# EasyEDA Pro project gamepad.eprj

# Schematic Schematic1
Board Name: Board1; Create Date: 2025-08-29; Page Name: P1; Project Name: gamepad; Schematic Name: Schematic1; Update Date: 2025-08-31; Company: EasyEDA.com; Page Size: A4; Version: V1.0
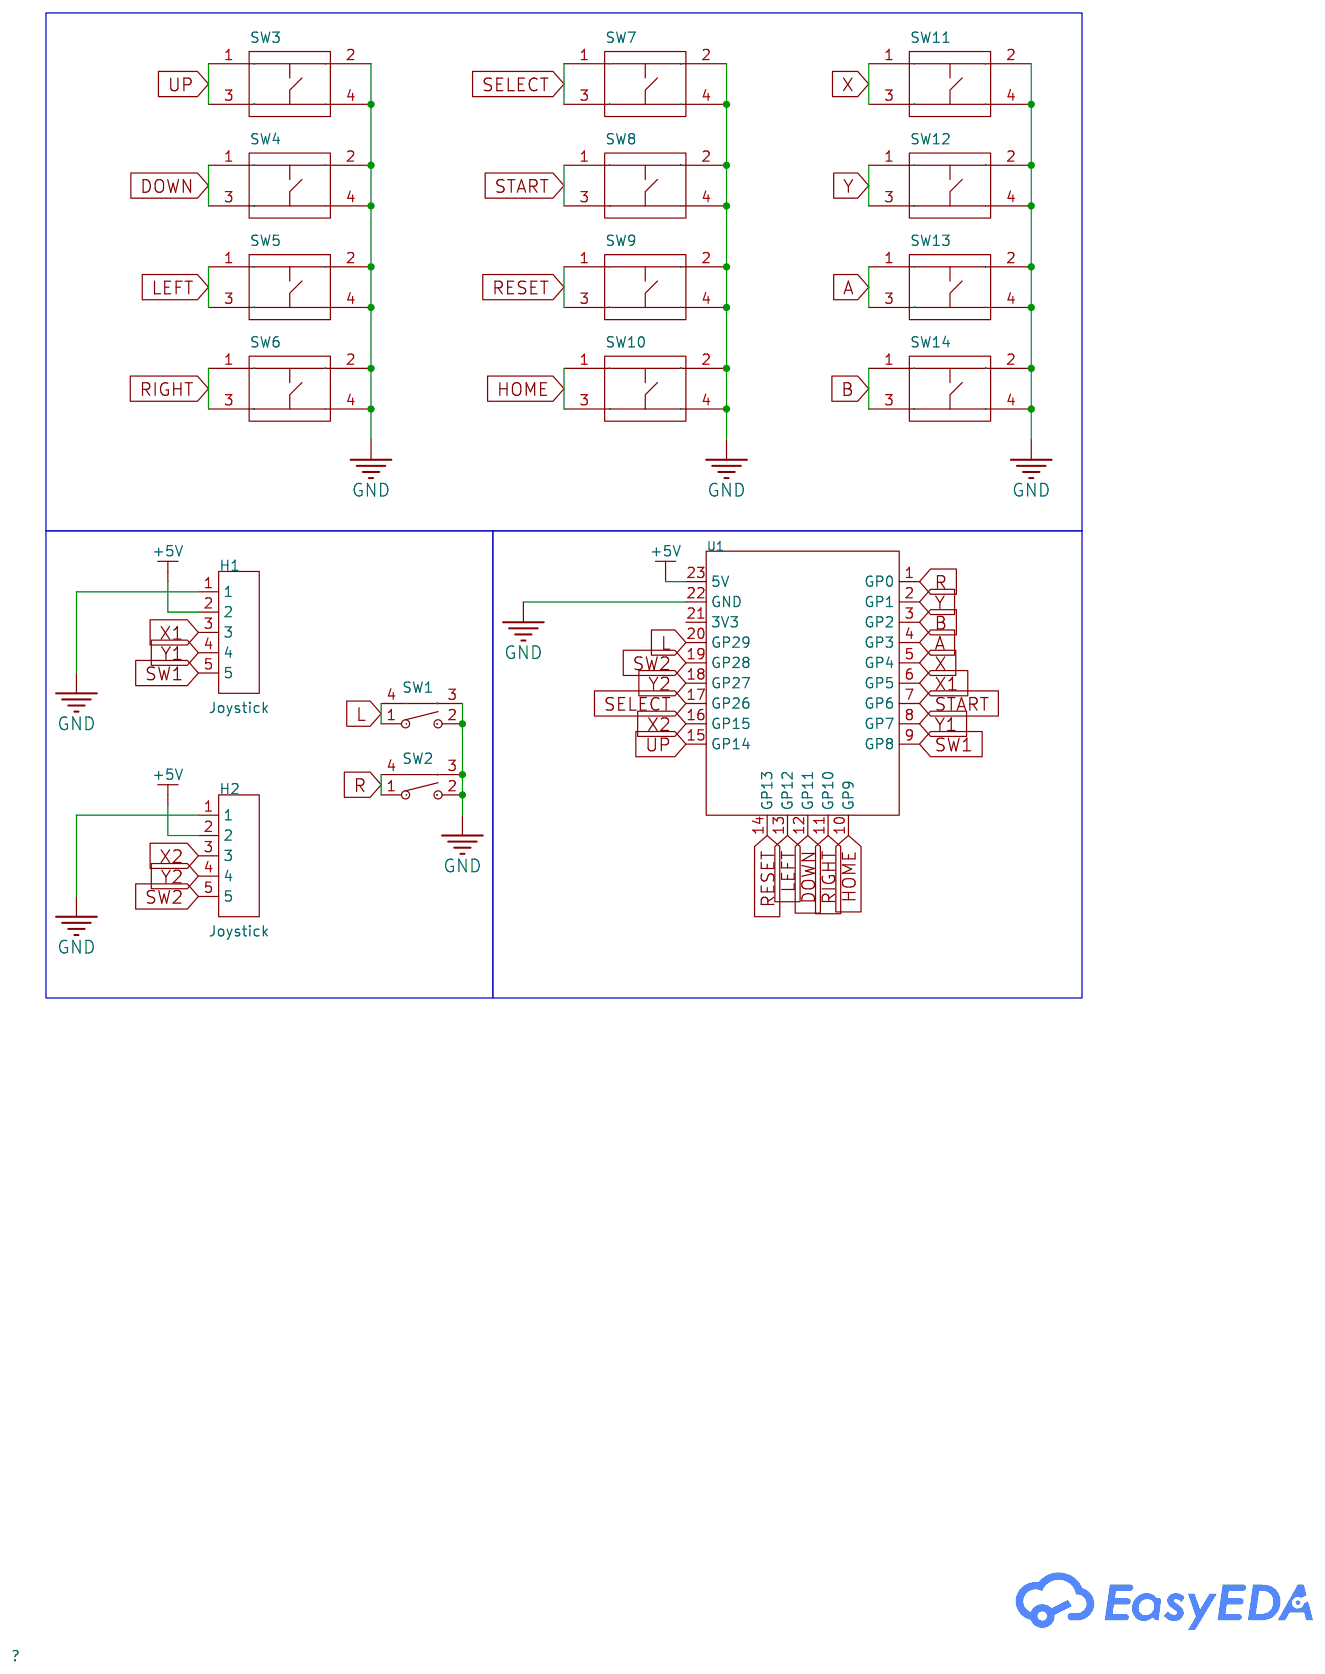
[diagram p0: schematic sheet]

## Parts
H1  Joystick  [HDR-TH_5P-P2.54_HTSW-105-08-F-S]
H2  Joystick  [HDR-TH_5P-P2.54_HTSW-105-08-F-S]
SW1  K2-1102AQ-H4CW-01  [SW-TH_K2-1102BQ-G4CW-01]
SW2  K2-1102AQ-H4CW-01  [SW-TH_K2-1102BQ-G4CW-01]
SW3  K2-1102DP-C4SW-04  [KEY-TH_4P-L6.0-W6.0-P4.50-LS6.50]
SW4  K2-1102DP-C4SW-04  [KEY-TH_4P-L6.0-W6.0-P4.50-LS6.50]
SW5  K2-1102DP-C4SW-04  [KEY-TH_4P-L6.0-W6.0-P4.50-LS6.50]
SW6  K2-1102DP-C4SW-04  [KEY-TH_4P-L6.0-W6.0-P4.50-LS6.50]
SW7  K2-1102DP-C4SW-04  [KEY-TH_4P-L6.0-W6.0-P4.50-LS6.50]
SW8  K2-1102DP-C4SW-04  [KEY-TH_4P-L6.0-W6.0-P4.50-LS6.50]
SW9  K2-1102DP-C4SW-04  [KEY-TH_4P-L6.0-W6.0-P4.50-LS6.50]
SW10  K2-1102DP-C4SW-04  [KEY-TH_4P-L6.0-W6.0-P4.50-LS6.50]
SW11  K2-1102DP-C4SW-04  [KEY-TH_4P-L6.0-W6.0-P4.50-LS6.50]
SW12  K2-1102DP-C4SW-04  [KEY-TH_4P-L6.0-W6.0-P4.50-LS6.50]
SW13  K2-1102DP-C4SW-04  [KEY-TH_4P-L6.0-W6.0-P4.50-LS6.50]
SW14  K2-1102DP-C4SW-04  [KEY-TH_4P-L6.0-W6.0-P4.50-LS6.50]
U1  RP2040-Zero  [RP2040_Zero]

## Library data of the parts
H1 H2 = MTSW-105-22-F-S-370: Pitch:2.54mm Mounting Type:Through Hole Number of Rows:1 Number of Pins:5P Current Rating:3A Contact Material:Phosphor Bronze Contact Plating:Tin Operating Temperature:-55℃~+125℃ Operating Temperature:-55℃~+125℃ Color:Black; LCSC Part Name: 间距:2.54mm 直插; Supplier Part: C5791520; Manufacturer: SAMTEC; Supplier Footprint: 插件,P=2.54mm; JLCPCB Part Class: Extended Part; Datasheet: https://item.szlcsc.com/datasheet/MTSW-105-22-F-S-370/6719220.html; Supplier: LCSC; Pitch: 2.54mm; Mounting Type: Through Hole; Number of Rows: 1; Number of Pins: 5P; Current Rating: 3A; Contact Material: Phosphor Bronze; Contact Plating: Tin; Operating Temperature: -55℃~+125℃; Color: Black
SW1 SW2 = K2-1102AQ-H4CW-01: LCSC Part Name: 6*6*7.5 带支架侧按键; Supplier Part: C961738; Manufacturer: 韩国韩荣; Supplier Footprint: 插件; Datasheet: https://atta.szlcsc.com/upload/public/pdf/source/20200930/C879477_AE832093E9AD0259B01FEE80C7CCB682.pdf; Supplier: LCSC; Operating Force: 250gf; Mounting Style: Lying; Switch Length: 6mm; Switch Width: 6mm; Switch Height: 7.5mm; Strike Gundam: 带支架; Contact Current: 50mA; Voltage Rating (DC): 12V; Insulation Resistance: 100MΩ; Mechanical Life: 10万次; Operating Temperature: -25℃~+85℃
SW3-SW14 = K2-1102DP-C4SW-04: LCSC Part Name: 轻触按键开关6*6*5; Supplier Part: C110153; Manufacturer: 韩国韩荣; Supplier Footprint: 插件; Datasheet: https://atta.szlcsc.com/upload/public/pdf/source/20210810/D0CD9D77408EACA829A5E533AC6E5B1E.pdf; Supplier: LCSC; Circuit: SPST; Actuator Style: Round Button; Operating Force: 250gf; Mounting Style: Straight; Switch Length: 6mm; Switch Width: 6mm; Switch Height: 5mm; Contact Current: 50mA; Voltage Rating (DC): 12V; Insulation Resistance: 100MΩ; Mechanical Life: 10万次; Operating Temperature: -25℃~+85℃
U1 = RP2040-Zero: LCSC Part Name: 微雪 树莓派RP2040-Zero微控制器 PICO开发板 RP2040双核处理器; Supplier Part: C5350143; Manufacturer: Waveshare(微雪电子); Supplier Footprint: LCC-22(18x23.5); JLCPCB Part Class: Extended Part; Datasheet: https://item.szlcsc.com/datasheet/RP2040-Zero/6136910.html; Supplier: LCSC

## Nets
+5V: H1.2 H2.2 U1.23(5V)
GND: H1.1 H2.1 SW1.2 SW1.3 SW2.2 SW2.3 SW3.2 SW3.4 SW4.2 SW4.4 SW5.2 SW5.4 SW6.2 SW6.4 SW7.2 SW7.4 SW8.2 SW8.4 SW9.2 SW9.4 SW10.2 SW10.4 SW11.2 SW11.4 SW12.2 SW12.4 SW13.2 SW13.4 SW14.2 SW14.4 U1.22(GND)
A: SW13.1 SW13.3 U1.4(GP3)
B: SW14.1 SW14.3 U1.3(GP2)
DOWN: SW4.1 SW4.3 U1.12(GP11)
HOME: SW10.1 SW10.3 U1.10(GP9)
L: SW1.1 SW1.4 U1.20(GP29)
LEFT: SW5.1 SW5.3 U1.13(GP12)
R: SW2.1 SW2.4 U1.1(GP0)
RESET: SW9.1 SW9.3 U1.14(GP13)
RIGHT: SW6.1 SW6.3 U1.11(GP10)
SELECT: SW7.1 SW7.3 U1.17(GP26)
START: SW8.1 SW8.3 U1.7(GP6)
SW1: H1.5 U1.9(GP8)
SW2: H2.5 U1.19(GP28)
UP: SW3.1 SW3.3 U1.15(GP14)
X: SW11.1 SW11.3 U1.5(GP4)
X1: H1.3 U1.6(GP5)
X2: H2.3 U1.16(GP15)
Y: SW12.1 SW12.3 U1.2(GP1)
Y1: H1.4 U1.8(GP7)
Y2: H2.4 U1.18(GP27)

Not connected (* = marked no-connect by the designer): U1 21(3V3)

# Board PCB1
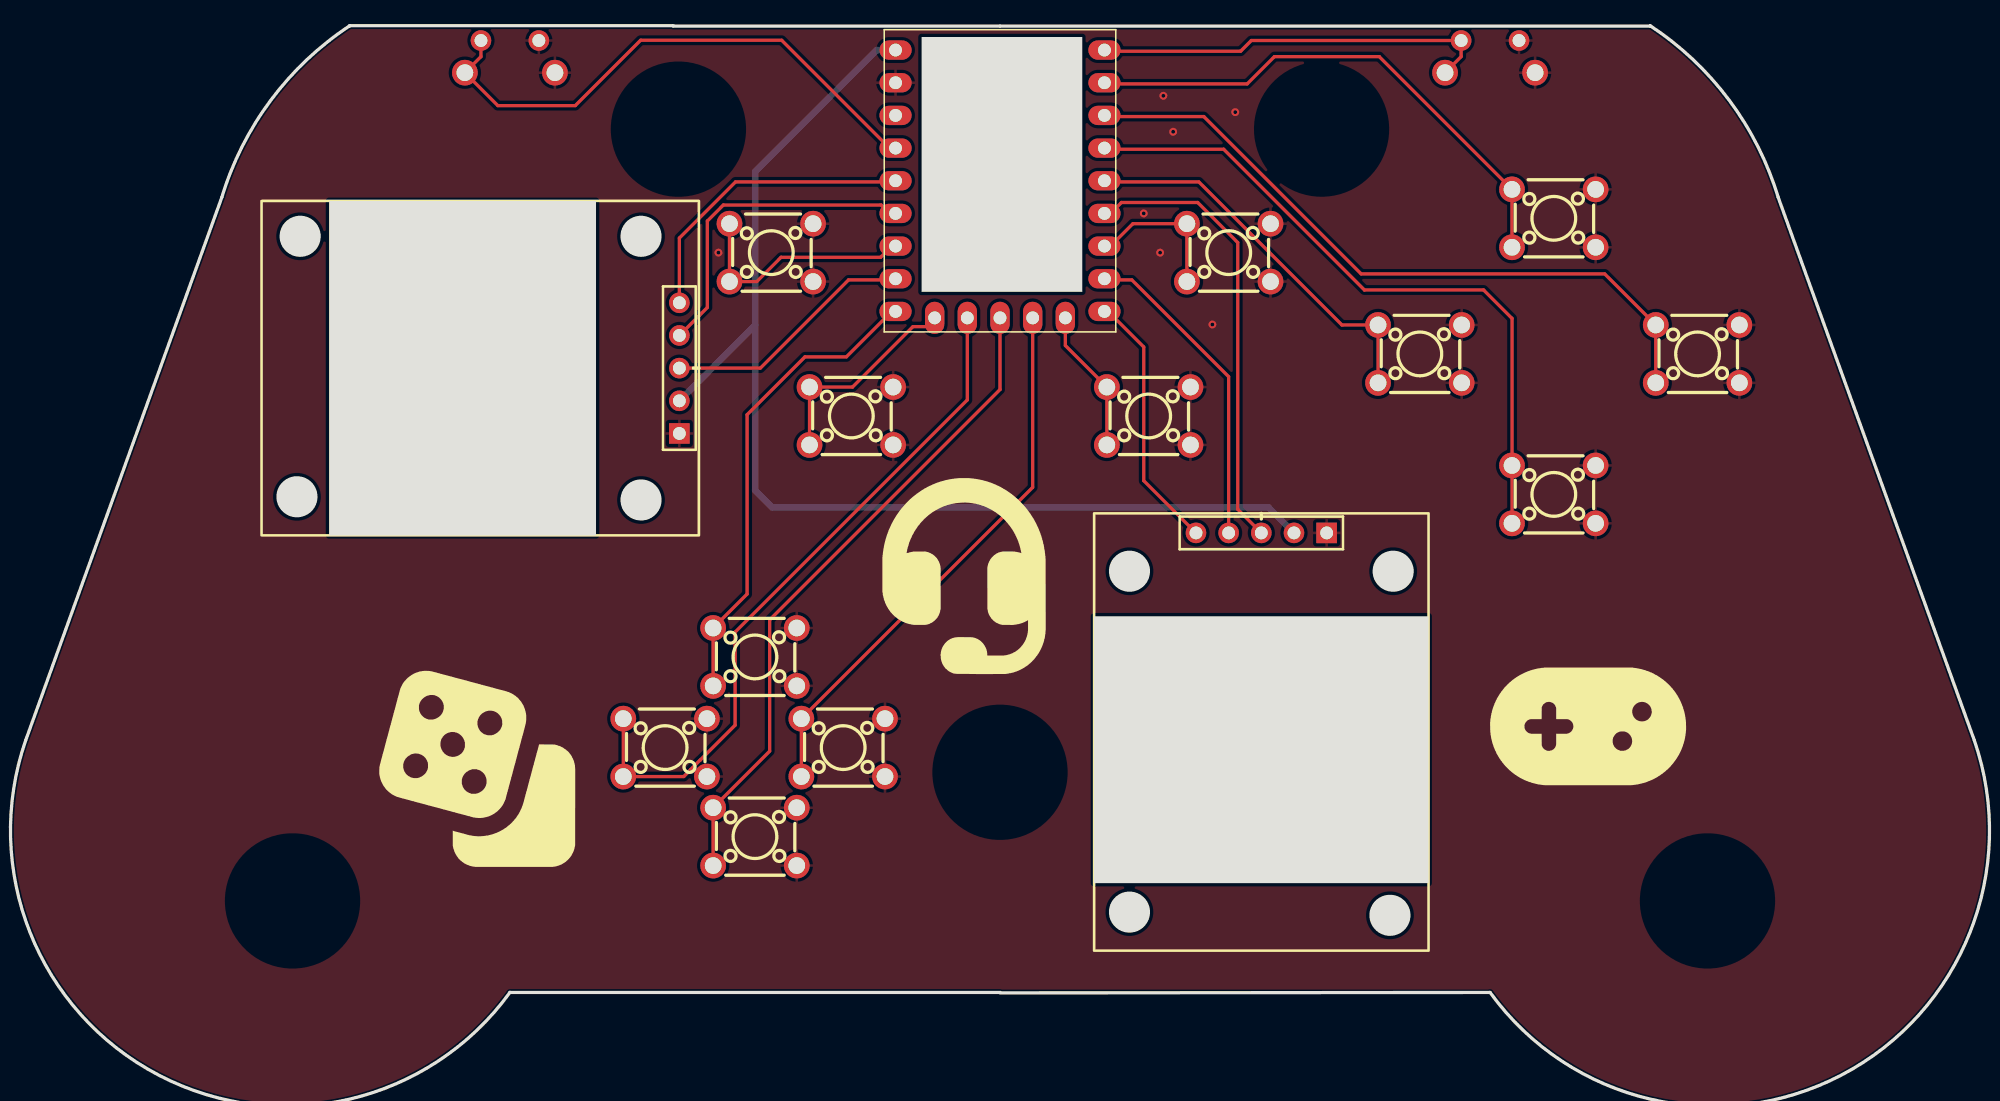
[diagram p1: board, top side]
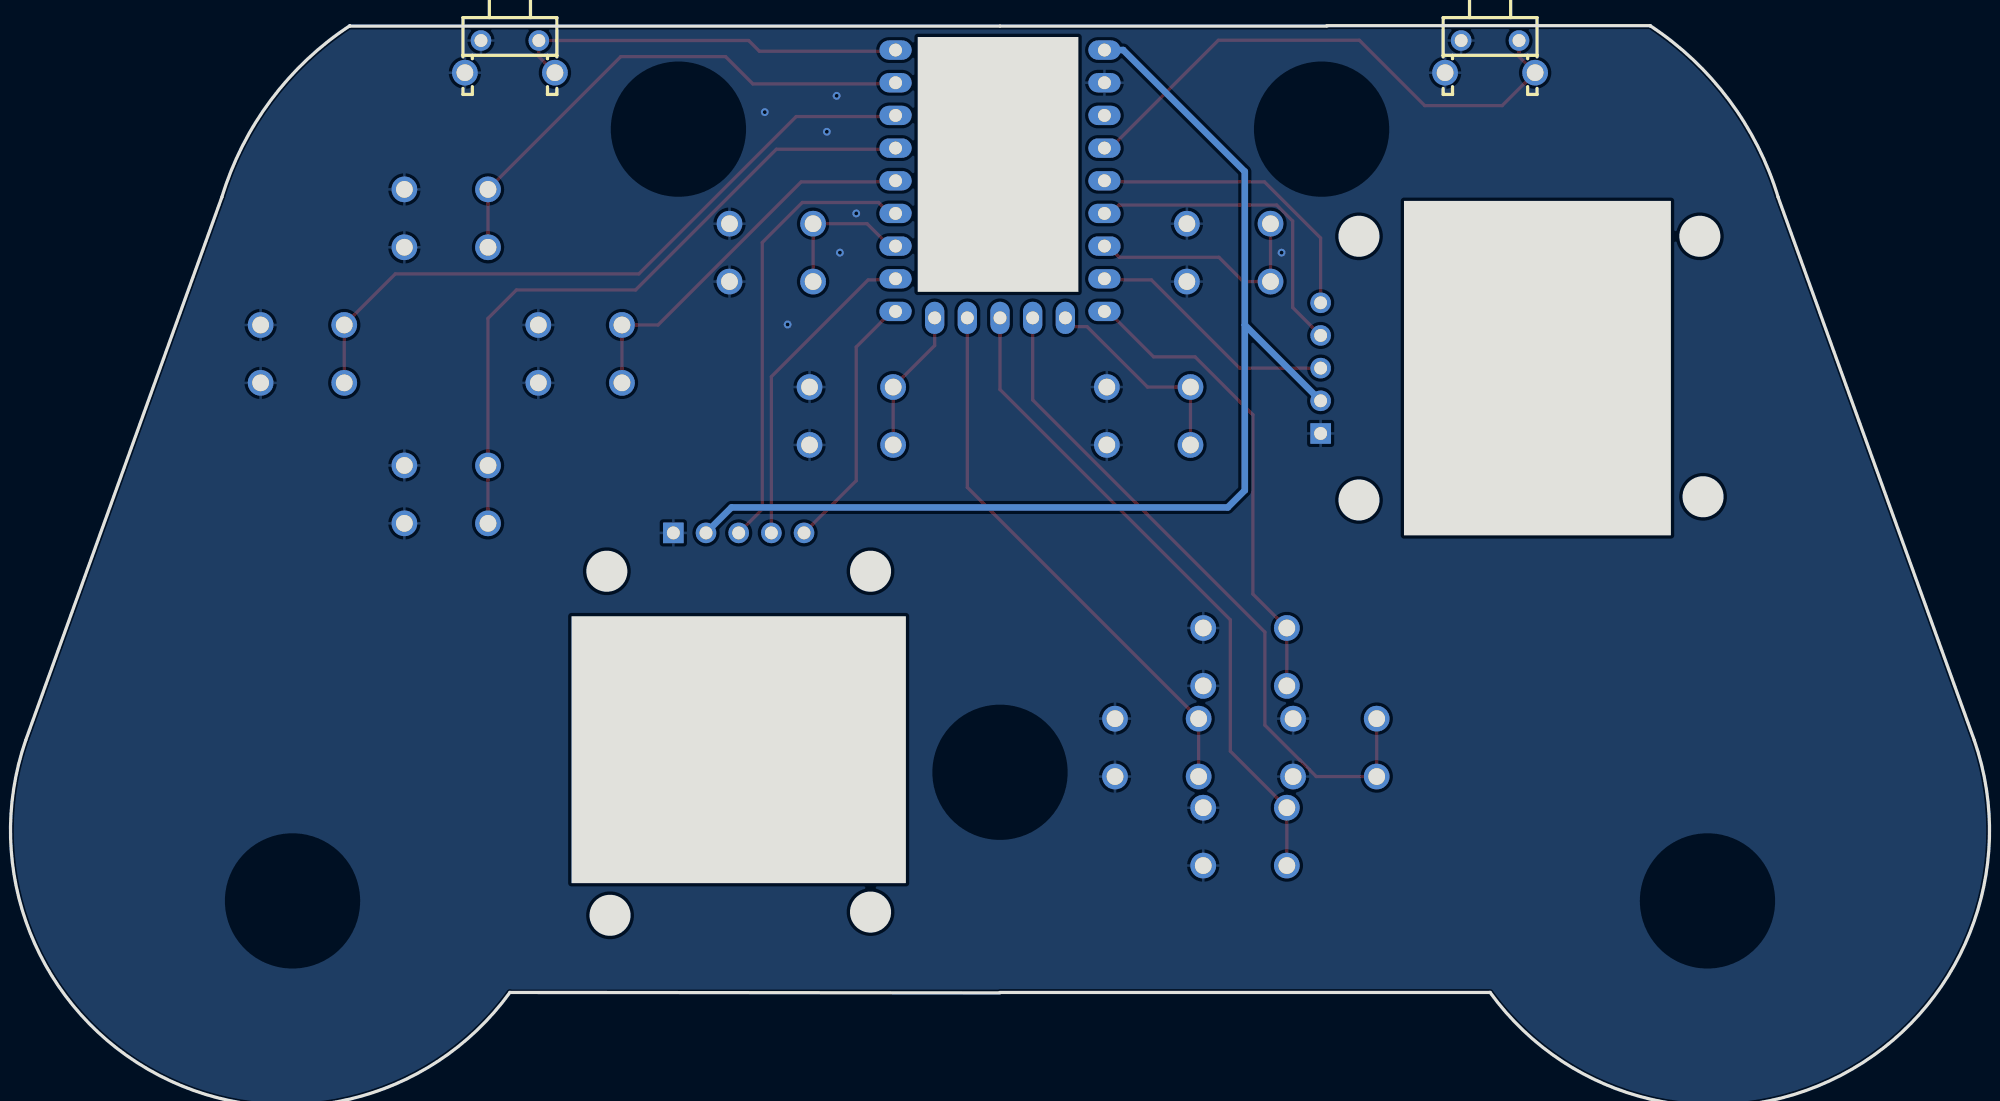
[diagram p2: board, bottom side, seen from below]

Outline 153.84 x 84.02 mm; copper layers: Top Layer, Bottom Layer. Coordinates in mm from the lower left corner of the outline.
Outline path: 26.37,84.03 arc(20.23,78.23) 16.43,70.7 1.18,28.48 arc(11.54,2.43) 38.82,8.87 76.92,8.87 ; 26.37,84.03 26.36,84.01 ; 26.37,84.03 51.52,84.03 ; 51.52,84 127.47,84 127.47,84.03 arc(133.61,78.24) 137.41,70.7 152.66,28.48 arc(142.3,2.43) 115.02,8.87 76.92,8.83
Stack: Top Layer 0.035mm / Dielectric1 1.51mm FR4 er 4.5 / Bottom Layer 0.035mm

## Design rules (mm)
template: JLCPCB Capability(Two Layers Board)
spacing copperThickness1oz (default): track to track 0.102, other pairs 0.152 to 0.3
spacing copperThickness2oz: track to track 0.203, other pairs 0.152 to 0.3
track width copperThickness1oz (default): min 0.127, default 0.254, max 2.54
track width copperThickness2oz: min 0.203, default 0.254, max 2.54
differential pair differentialPair (default): width min 0.127, default 0.254, max 2.54; gap min 0.152, default 0.152
via viaSize (default): diameter min 0.5, default 0.61, max 10; hole min 0.3, default 0.305, max 6.3

## Placement (name value [footprint] x y rotation side)
H1  Joystick  [HDR-TH_5P-P2.54_HTSW-105-08-F-S]  97.24 44.85 180 top
H2  Joystick  [HDR-TH_5P-P2.54_HTSW-105-08-F-S]  52.24 57.41 90 top
SW1  K2-1102AQ-H4CW-01  [SW-TH_K2-1102BQ-G4CW-01]  38.82 81.63 0 bottom
SW2  K2-1102AQ-H4CW-01  [SW-TH_K2-1102BQ-G4CW-01]  115.02 81.63 0 bottom
SW3  K2-1102DP-C4SW-04  [KEY-TH_4P-L6.0-W6.0-P4.50-LS6.50]  57.87 34.95 0 top
SW4  K2-1102DP-C4SW-04  [KEY-TH_4P-L6.0-W6.0-P4.50-LS6.50]  57.87 20.98 0 top
SW5  K2-1102DP-C4SW-04  [KEY-TH_4P-L6.0-W6.0-P4.50-LS6.50]  50.89 27.9 0 top
SW6  K2-1102DP-C4SW-04  [KEY-TH_4P-L6.0-W6.0-P4.50-LS6.50]  64.73 27.9 0 top
SW7  K2-1102DP-C4SW-04  [KEY-TH_4P-L6.0-W6.0-P4.50-LS6.50]  59.14 66.39 0 top
SW8  K2-1102DP-C4SW-04  [KEY-TH_4P-L6.0-W6.0-P4.50-LS6.50]  94.7 66.39 0 top
SW9  K2-1102DP-C4SW-04  [KEY-TH_4P-L6.0-W6.0-P4.50-LS6.50]  65.36 53.69 0 top
SW10  K2-1102DP-C4SW-04  [KEY-TH_4P-L6.0-W6.0-P4.50-LS6.50]  88.48 53.69 0 top
SW11  K2-1102DP-C4SW-04  [KEY-TH_4P-L6.0-W6.0-P4.50-LS6.50]  109.56 58.51 0 top
SW12  K2-1102DP-C4SW-04  [KEY-TH_4P-L6.0-W6.0-P4.50-LS6.50]  119.97 69.05 0 top
SW13  K2-1102DP-C4SW-04  [KEY-TH_4P-L6.0-W6.0-P4.50-LS6.50]  119.97 47.59 0 top
SW14  K2-1102DP-C4SW-04  [KEY-TH_4P-L6.0-W6.0-P4.50-LS6.50]  131.15 58.51 0 top
U1  RP2040-Zero  [RP2040_Zero]  76.92 71.97 0 top

## Footprints (pads in the part's own frame, mm; a bottom-side part is the same pattern mirrored in y, then rotated)
HDR-TH_5P-P2.54_HTSW-105-08-F-S
  rect 1.6x1.6 hole 1: 1(-5.08,0.25)
  round 1.6 hole 1: 2(-2.54,0.25) 3(0,0.25) 4(2.54,0.25) 5(5.08,0.25)
KEY-TH_4P-L6.0-W6.0-P4.50-LS6.50
  round 2 hole 1.3: 1(-3.25,2.25) 2(3.25,2.25) 3(-3.25,-2.25) 4(3.25,-2.25)
RP2040_Zero
  oval 2.5x1.5 hole 1: 1(8.12,10.16) 2(8.12,7.62) 3(8.12,5.08) 4(8.12,2.54) 5(8.12,0) 6(8.12,-2.54) 7(8.12,-5.08) 8(8.12,-7.62) 9(8.12,-10.16) 15(-8.12,-10.16) 16(-8.12,-7.62) 17(-8.12,-5.08) 18(-8.12,-2.54) 19(-8.12,0) 20(-8.12,2.54) 21(-8.12,5.08) 22(-8.12,7.62) 23(-8.12,10.16)
  oval 1.5x2.5 hole 1: 10(5.08,-10.66) 11(2.54,-10.66) 12(0,-10.66) 13(-2.54,-10.66) 14(-5.08,-10.66)
SW-TH_K2-1102BQ-G4CW-01
  round 1.6 hole 1: 1(-2.25,-1.25) 2(2.25,-1.25)
  round 2 hole 1.3: 3(3.5,1.25) 4(-3.5,1.25)

## Nets
As in the schematic.

Pads without a net: U1 21

## Via types
v1: diameter 0.61, hole 0.305, Top Layer to Bottom Layer, 7 vias

## Routing (per net, layer and track width the routed paths; a pad name or vN(x,y) marks a point on that pad's centre or on a via; arc(x,y) is an arc through that point)
+5V: length 91.2
  Bottom Layer w0.508: U1.23 67.34,82.13 57.89,72.68 57.89,60.76 ; H1.2 97.79,46.58 59.22,46.58 57.89,47.9 57.89,60.76 ; 57.89,60.76 H2.2
GND:
  vias: v1(55.03,66.39) v1(88.1,69.43) v1(89.37,66.39) v1(89.62,78.58) v1(90.38,75.78) v1(93.43,60.8) v1(95.21,77.31)
A: length 52.7
  Top Layer w0.254: 85.42,74.42 94.31,74.42 105.25,63.48 114.51,63.48 116.73,61.27 116.73,45.34 SW13.3
B: length 53.7
  Top Layer w0.254: 85.42,76.96 92.77,76.96 105,64.73 123.93,64.73 SW14.1 SW14.3
DOWN: length 51.1
  Top Layer w0.254: 76.92,60.63 76.92,55.74 59.01,37.84 59.01,27.63 SW4.1 SW4.3
HOME: length 10.5
  Top Layer w0.254: 82,60.63 82,59.16 SW10.1 SW10.3
L: length 42.8
  Top Layer w0.254: 68.42,74.42 59.95,82.9 48.98,82.9 43.9,77.82 37.88,77.82 SW1.4 36.57,81.63 SW1.1
LEFT: length 53.3
  Top Layer w0.254: SW5.1 SW5.3 52.34,25.65 52.86,26.17 52.86,26.18 53.61,26.93 53.62,26.93 56.33,29.64 56.33,36.88 74.38,54.94 74.38,60.63
R: length 30.7
  Top Layer w0.254: SW2.4 112.77,81.63 SW2.1 96.46,82.88 95.63,82.04 85.42,82.04
RESET: length 16.2
  Top Layer w0.254: SW9.3 SW9.1 65.45,55.94 70.15,60.63 71.84,60.63
RIGHT: length 42.4
  Top Layer w0.254: 79.46,60.63 79.46,48.14 SW6.1 SW6.3
SELECT: length 18.1
  Top Layer w0.254: SW7.1 SW7.3 58.01,64.14 59.9,66.02 67.64,66.02 68.42,66.8
START: length 11.3
  Top Layer w0.254: SW8.3 SW8.1 87.25,68.64 85.42,66.8
SW1: length 19.9
  Top Layer w0.254: 92.16,44.6 88.1,48.66 88.1,59.05 85.42,61.72
SW2: length 23.3
  Top Layer w0.254: 68.42,71.88 56.36,71.88 51.99,67.52 H2.5
UP: length 36.6
  Top Layer w0.254: SW3.3 SW3.1 57.26,39.84 57.26,53.79 61.76,58.28 64.98,58.28 68.42,61.72
X: length 30
  Top Layer w0.254: 85.42,71.88 92.38,71.88 103.5,60.76 SW11.1 SW11.3
X1: length 35
  Top Layer w0.254: H1.3 95.4,46.43 95.4,67.17 92.29,70.28 86.36,70.28 85.42,69.34
X2: length 19.3
  Top Layer w0.254: 68.42,64.26 65.15,64.26 58.29,57.41 H2.3
Y: length 41
  Top Layer w0.254: 85.42,79.5 96.13,79.5 98.26,81.63 106.4,81.63 SW12.1 SW12.3
Y1: length 24.5
  Top Layer w0.254: H1.4 94.7,56.74 87.17,64.26 85.42,64.26
Y2: length 24.9
  Top Layer w0.254: 68.42,69.34 67.68,70.09 55.41,70.09 54.17,68.84 54.17,62.12 51.99,59.95

## Copper pours and planes (outline as drawn; the poured copper is in the pictures)
GND on Top Layer: -0.8,88.23 154.64,88.23 154.64,-3.72 -0.8,-3.72
GND on Bottom Layer: -0.8,88.23 154.64,88.23 154.64,-3.72 -0.8,-3.72
